# Altium schematic sheet Temperature Sensor.SchDoc
size A4; DrawnBy: Craig Comberbach; DocumentNumber: 5; Revision: A1; SheetNumber: 5; SheetTotal: 7
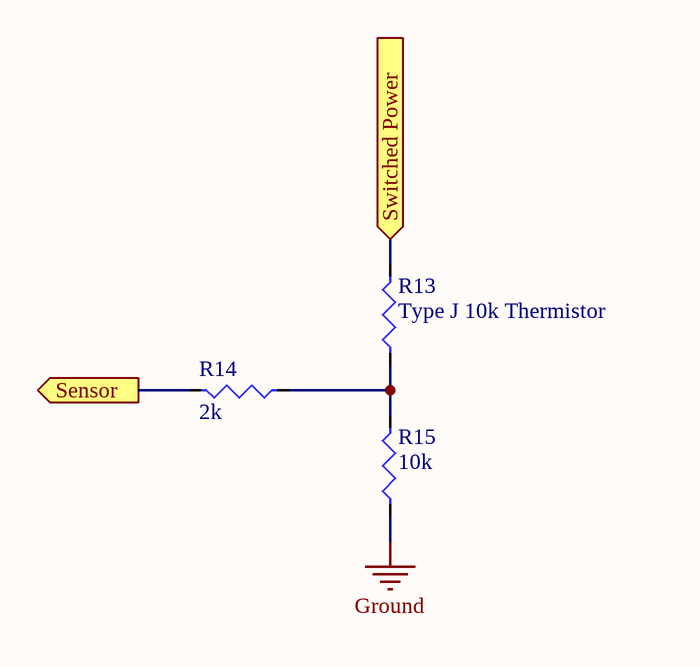
[diagram p0: Temperature Sensor.SchDoc]

## Parts
R13  QuickValue: Type J 10k Thermistor  [RESISTOR THT 3W 0.05HOLE 900MIL]  (hidden comment: Resistor)
R14  QuickValue: 2k  [RESISTOR THT 3W 0.05HOLE 900MIL]  (hidden comment: Resistor)
R15  QuickValue: 10k  [RESISTOR THT 3W 0.05HOLE 900MIL]  (hidden comment: Resistor)

## Ports
Sensor (out), Switched Power (in)

## Nets
Ground: R15.1
Sensor: R14.2 ; port Sensor
Switched Power: R13.2 ; port Switched Power
NetR13_1: R13.1 R14.1 R15.2

## Library data of the parts
R13 = Resistor: Value: Type J 10k Thermistor 1/4W 1%; Tolerance: 1%; Technology: THT; Supplier 1: Digi-Key; Supplier Part Number 1: 615-1016-ND; Package: 1/4W
R14 = Resistor: Value: 2k 1/4W 1%; Tolerance: 1%; Technology: THT; Supplier 1: Digi-Key; Supplier Part Number 1: 2.00KXBK-ND; Package: 1/4W
R15 = Resistor: Value: 10k 1/4W 1%; Tolerance: 1%; Technology: THT; Supplier 1: Digi-Key; Supplier Part Number 1: 10.0KXBK-ND; Package: 1/4W